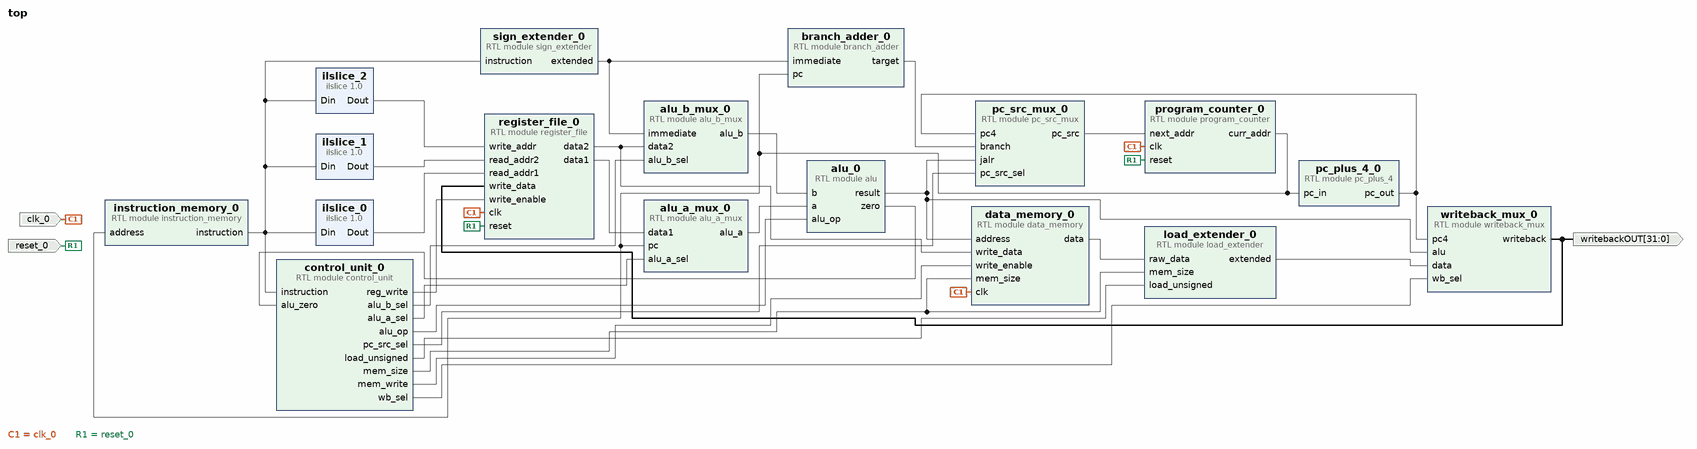
[diagram p0: block diagram of the top level]
# Vivado block design top, xc7a35tcpg236-1, Vivado 2025.1
create_bd_design top

create_bd_port -dir I -type clk clk_0
create_bd_port -dir I -type rst reset_0
create_bd_port -dir O -from 31 -to 0 -type data writebackOUT

create_bd_cell -type module -reference program_counter program_counter_0
create_bd_cell -type module -reference pc_plus_4 pc_plus_4_0
create_bd_cell -type module -reference instruction_memory instruction_memory_0
create_bd_cell -type module -reference control_unit control_unit_0
create_bd_cell -type module -reference register_file register_file_0
create_bd_cell -type module -reference alu alu_0
create_bd_cell -type module -reference data_memory data_memory_0
create_bd_cell -type module -reference alu_a_mux alu_a_mux_0
create_bd_cell -type module -reference alu_b_mux alu_b_mux_0
create_bd_cell -type module -reference branch_adder branch_adder_0
create_bd_cell -type module -reference pc_src_mux pc_src_mux_0
create_bd_cell -type module -reference sign_extender sign_extender_0
create_bd_cell -type module -reference writeback_mux writeback_mux_0
create_bd_cell -type module -reference load_extender load_extender_0
create_bd_cell -type inline_hdl -vlnv xilinx.com:inline_hdl:ilslice:1.0 ilslice_0
set_property -dict {CONFIG.DIN_FROM 19 CONFIG.DIN_TO 15 CONFIG.DIN_WIDTH 32} [get_bd_cells ilslice_0]
create_bd_cell -type inline_hdl -vlnv xilinx.com:inline_hdl:ilslice:1.0 ilslice_1
set_property -dict {CONFIG.DIN_FROM 24 CONFIG.DIN_TO 20} [get_bd_cells ilslice_1]
create_bd_cell -type inline_hdl -vlnv xilinx.com:inline_hdl:ilslice:1.0 ilslice_2
set_property -dict {CONFIG.DIN_FROM 11 CONFIG.DIN_TO 7} [get_bd_cells ilslice_2]

# ---- connections ----

connect_bd_net [get_bd_pins alu_0/result] [get_bd_pins data_memory_0/address] [get_bd_pins pc_src_mux_0/jalr] [get_bd_pins writeback_mux_0/alu]
connect_bd_net [get_bd_pins alu_0/zero] [get_bd_pins control_unit_0/alu_zero]
connect_bd_net [get_bd_pins alu_a_mux_0/alu_a] [get_bd_pins alu_0/a]
connect_bd_net [get_bd_pins alu_b_mux_0/alu_b] [get_bd_pins alu_0/b]
connect_bd_net [get_bd_pins branch_adder_0/target] [get_bd_pins pc_src_mux_0/branch]
connect_bd_net -net clk_0_1 [get_bd_ports clk_0] [get_bd_pins data_memory_0/clk] [get_bd_pins program_counter_0/clk] [get_bd_pins register_file_0/clk]
connect_bd_net [get_bd_pins control_unit_0/alu_a_sel] [get_bd_pins alu_a_mux_0/alu_a_sel]
connect_bd_net [get_bd_pins control_unit_0/alu_b_sel] [get_bd_pins alu_b_mux_0/alu_b_sel]
connect_bd_net [get_bd_pins control_unit_0/alu_op] [get_bd_pins alu_0/alu_op]
connect_bd_net [get_bd_pins control_unit_0/load_unsigned] [get_bd_pins load_extender_0/load_unsigned]
connect_bd_net [get_bd_pins control_unit_0/mem_size] [get_bd_pins data_memory_0/mem_size] [get_bd_pins load_extender_0/mem_size]
connect_bd_net [get_bd_pins control_unit_0/mem_write] [get_bd_pins data_memory_0/write_enable]
connect_bd_net [get_bd_pins control_unit_0/pc_src_sel] [get_bd_pins pc_src_mux_0/pc_src_sel]
connect_bd_net [get_bd_pins control_unit_0/reg_write] [get_bd_pins register_file_0/write_enable]
connect_bd_net [get_bd_pins control_unit_0/wb_sel] [get_bd_pins writeback_mux_0/wb_sel]
connect_bd_net [get_bd_pins data_memory_0/data] [get_bd_pins load_extender_0/raw_data]
connect_bd_net [get_bd_pins ilslice_0/Dout] [get_bd_pins register_file_0/read_addr1]
connect_bd_net [get_bd_pins ilslice_1/Dout] [get_bd_pins register_file_0/read_addr2]
connect_bd_net [get_bd_pins ilslice_2/Dout] [get_bd_pins register_file_0/write_addr]
connect_bd_net [get_bd_pins instruction_memory_0/instruction] \
  [get_bd_pins ilslice_0/Din] [get_bd_pins ilslice_1/Din] [get_bd_pins ilslice_2/Din] \
  [get_bd_pins control_unit_0/instruction] [get_bd_pins sign_extender_0/instruction]
connect_bd_net [get_bd_pins load_extender_0/extended] [get_bd_pins writeback_mux_0/data]
connect_bd_net [get_bd_pins pc_plus_4_0/pc_out] [get_bd_pins pc_src_mux_0/pc4] [get_bd_pins writeback_mux_0/pc4]
connect_bd_net [get_bd_pins pc_src_mux_0/pc_src] [get_bd_pins program_counter_0/next_addr]
connect_bd_net [get_bd_pins program_counter_0/curr_addr] \
  [get_bd_pins alu_a_mux_0/pc] [get_bd_pins branch_adder_0/pc] [get_bd_pins instruction_memory_0/address] \
  [get_bd_pins pc_plus_4_0/pc_in]
connect_bd_net [get_bd_pins register_file_0/data1] [get_bd_pins alu_a_mux_0/data1]
connect_bd_net [get_bd_pins register_file_0/data2] [get_bd_pins alu_b_mux_0/data2] [get_bd_pins data_memory_0/write_data]
connect_bd_net -net reset_0_1 [get_bd_ports reset_0] [get_bd_pins program_counter_0/reset] [get_bd_pins register_file_0/reset]
connect_bd_net [get_bd_pins sign_extender_0/extended] [get_bd_pins alu_b_mux_0/immediate] [get_bd_pins branch_adder_0/immediate]
connect_bd_net [get_bd_pins writeback_mux_0/writeback] [get_bd_ports writebackOUT] [get_bd_pins register_file_0/write_data]

validate_bd_design
save_bd_design
